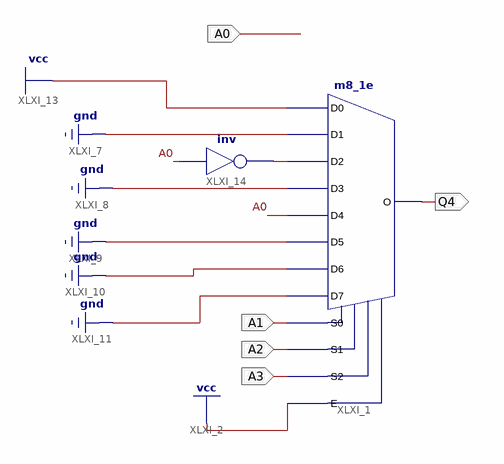
[diagram p0: schematic sheet 1]
// Xilinx ISE schematic Q4.sch (spartan3) as structural Verilog: 2 symbols, 5 ports
module Q4 (
  input  A0,
  input  A1,
  input  A2,
  input  A3,
  output Q4
);

  wire XLXN_17;

  m8_1e XLXI_1 (
    .D0(1'b1), .D1(1'b0), .D2(XLXN_17), .D3(1'b0), .D4(A0), .D5(1'b0), .D6(1'b0), .D7(1'b0), .E(1'b1),
    .S0(A1), .S1(A2), .S2(A3), .O(Q4));
  not XLXI_14 (XLXN_17, A0);
endmodule
